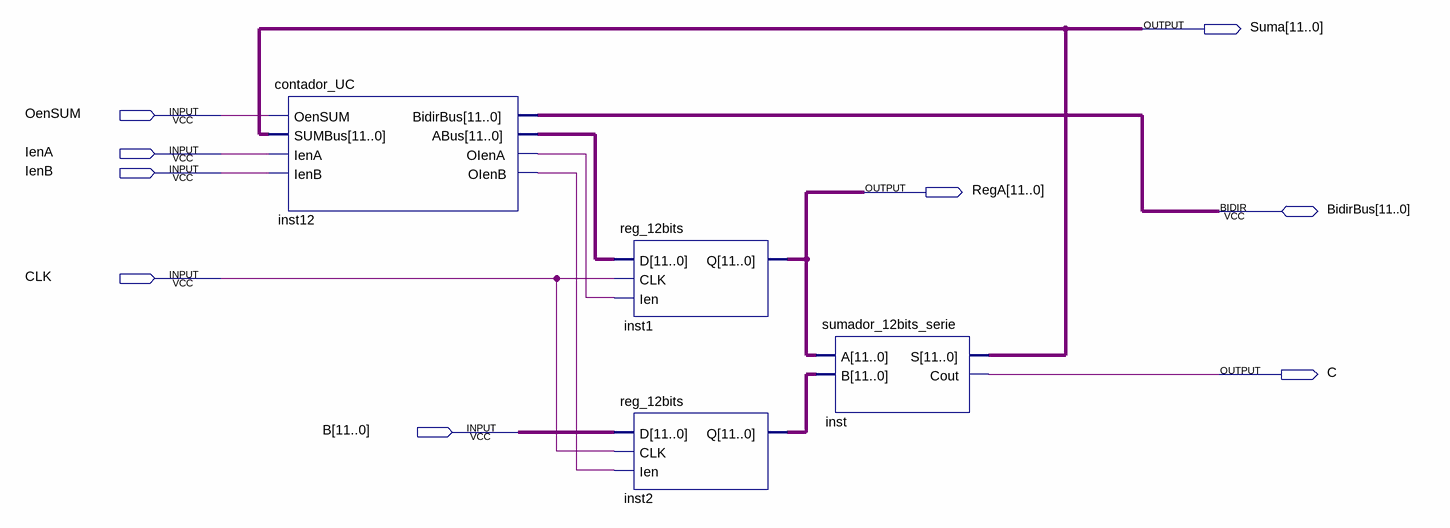
[diagram p0: schematic sheet]
// Quartus schematic contador_TOP.bdf as structural Verilog: 4 symbols, 9 pins
module contador_TOP (
  input  OenSUM,
  input  IenA,
  input  IenB,
  input  CLK,
  input  [11:0] B,
  inout  [11:0] BidirBus,
  output [11:0] Suma,
  output [11:0] RegA,
  output C
);

  wire inst12_oiena, inst12_oienb;
  wire [11:0] inst2_q, inst12_abus;

  contador_UC inst12 (
    .OenSUM(OenSUM), .SUMBus(Suma), .IenA(IenA), .IenB(IenB), .ABus(inst12_abus), .OIenA(inst12_oiena),
    .OIenB(inst12_oienb), .BidirBus(BidirBus));
  reg_12bits inst1 (.D(inst12_abus), .CLK(CLK), .Ien(inst12_oiena), .Q(RegA));
  reg_12bits inst2 (.D(B), .CLK(CLK), .Ien(inst12_oienb), .Q(inst2_q));
  sumador_12bits_serie inst (.A(RegA), .B(inst2_q), .S(Suma), .Cout(C));
endmodule
